# Altium schematic sheet Headers.SchDoc
size A4; SheetNumber: 11; SheetTotal: 16
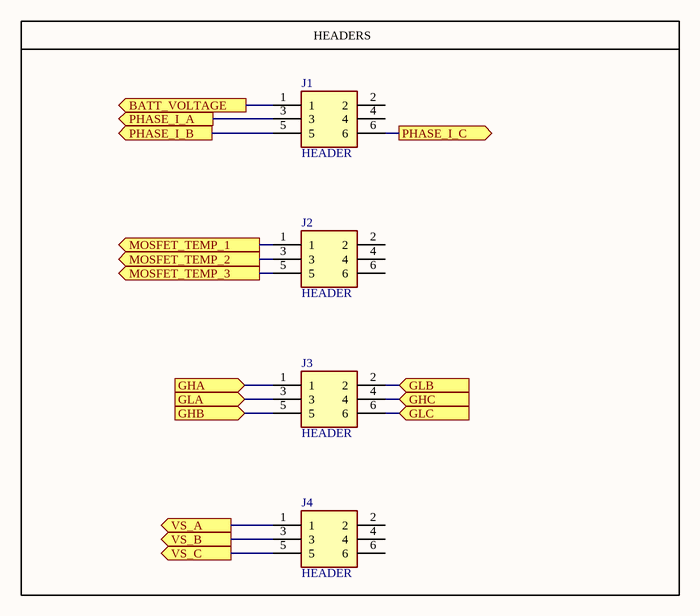
[diagram p0: Headers.SchDoc]

## Parts
J1  HEADER  [HEADER_FEMALE_SMD_2X3_1.27MM]
J2  HEADER  [HEADER_FEMALE_SMD_2X3_1.27MM]
J3  HEADER  [HEADER_FEMALE_SMD_2X3_1.27MM]
J4  HEADER  [HEADER_FEMALE_SMD_2X3_1.27MM]

## Blocks framed on the sheet
HEADERS: J1-J4

## Ports
BATT_VOLTAGE (out, see Interconnections[2B], AD_Converter[3A]), GHA (in, see Interconnections[2C], Gate_Drivers[2A]), GHB (in, see Interconnections[2C], Gate_Drivers[5A]), GHC (in, see Interconnections[2C], Gate_Drivers[7A]), GLA (in, see Interconnections[2C], Gate_Drivers[2B]), GLB (in, see Interconnections[2C], Gate_Drivers[5B]), GLC (in, see Interconnections[2C], Gate_Drivers[7B]), MOSFET_TEMP_1 (out, see Interconnections[2C], AD_Converter[3A]), MOSFET_TEMP_2 (out, see Interconnections[2C], AD_Converter[3A]), MOSFET_TEMP_3 (out, see Interconnections[2C], AD_Converter[3A]), PHASE_I_A (out, see Interconnections[2B], AD_Converter[3A]), PHASE_I_B (out, see Interconnections[2C], AD_Converter[3A]), PHASE_I_C (out, see Interconnections[2C], AD_Converter[3A]), VS_A (out, see Interconnections[2C], Gate_Drivers[3B]), VS_B (out, see Interconnections[2C], Gate_Drivers[5B]), VS_C (out, see Interconnections[2C], Gate_Drivers[8B])

## Nets
BATT_VOLTAGE: J1.1 ; port BATT_VOLTAGE
GHA: J3.1 ; port GHA
GHB: J3.5 ; port GHB
GHC: J3.4 ; port GHC
GLA: J3.3 ; port GLA
GLB: J3.2 ; port GLB
GLC: J3.6 ; port GLC
MOSFET_TEMP_1: J2.1 ; port MOSFET_TEMP_1
MOSFET_TEMP_2: J2.3 ; port MOSFET_TEMP_2
MOSFET_TEMP_3: J2.5 ; port MOSFET_TEMP_3
PHASE_I_A: J1.3 ; port PHASE_I_A
PHASE_I_B: J1.5 ; port PHASE_I_B
PHASE_I_C: J1.6 ; port PHASE_I_C
VS_A: J4.1 ; port VS_A
VS_B: J4.3 ; port VS_B
VS_C: J4.5 ; port VS_C

Not connected (* = marked no-connect by the designer): J1 2 4; J2 2 4 6; J4 2 4 6

## Library data of the parts
J1-J4 = HEADER_SMD_2X3_1.27MM